# EAGLE design SAE_Shifter_Schem_no_micro (EAGLE 6.1)
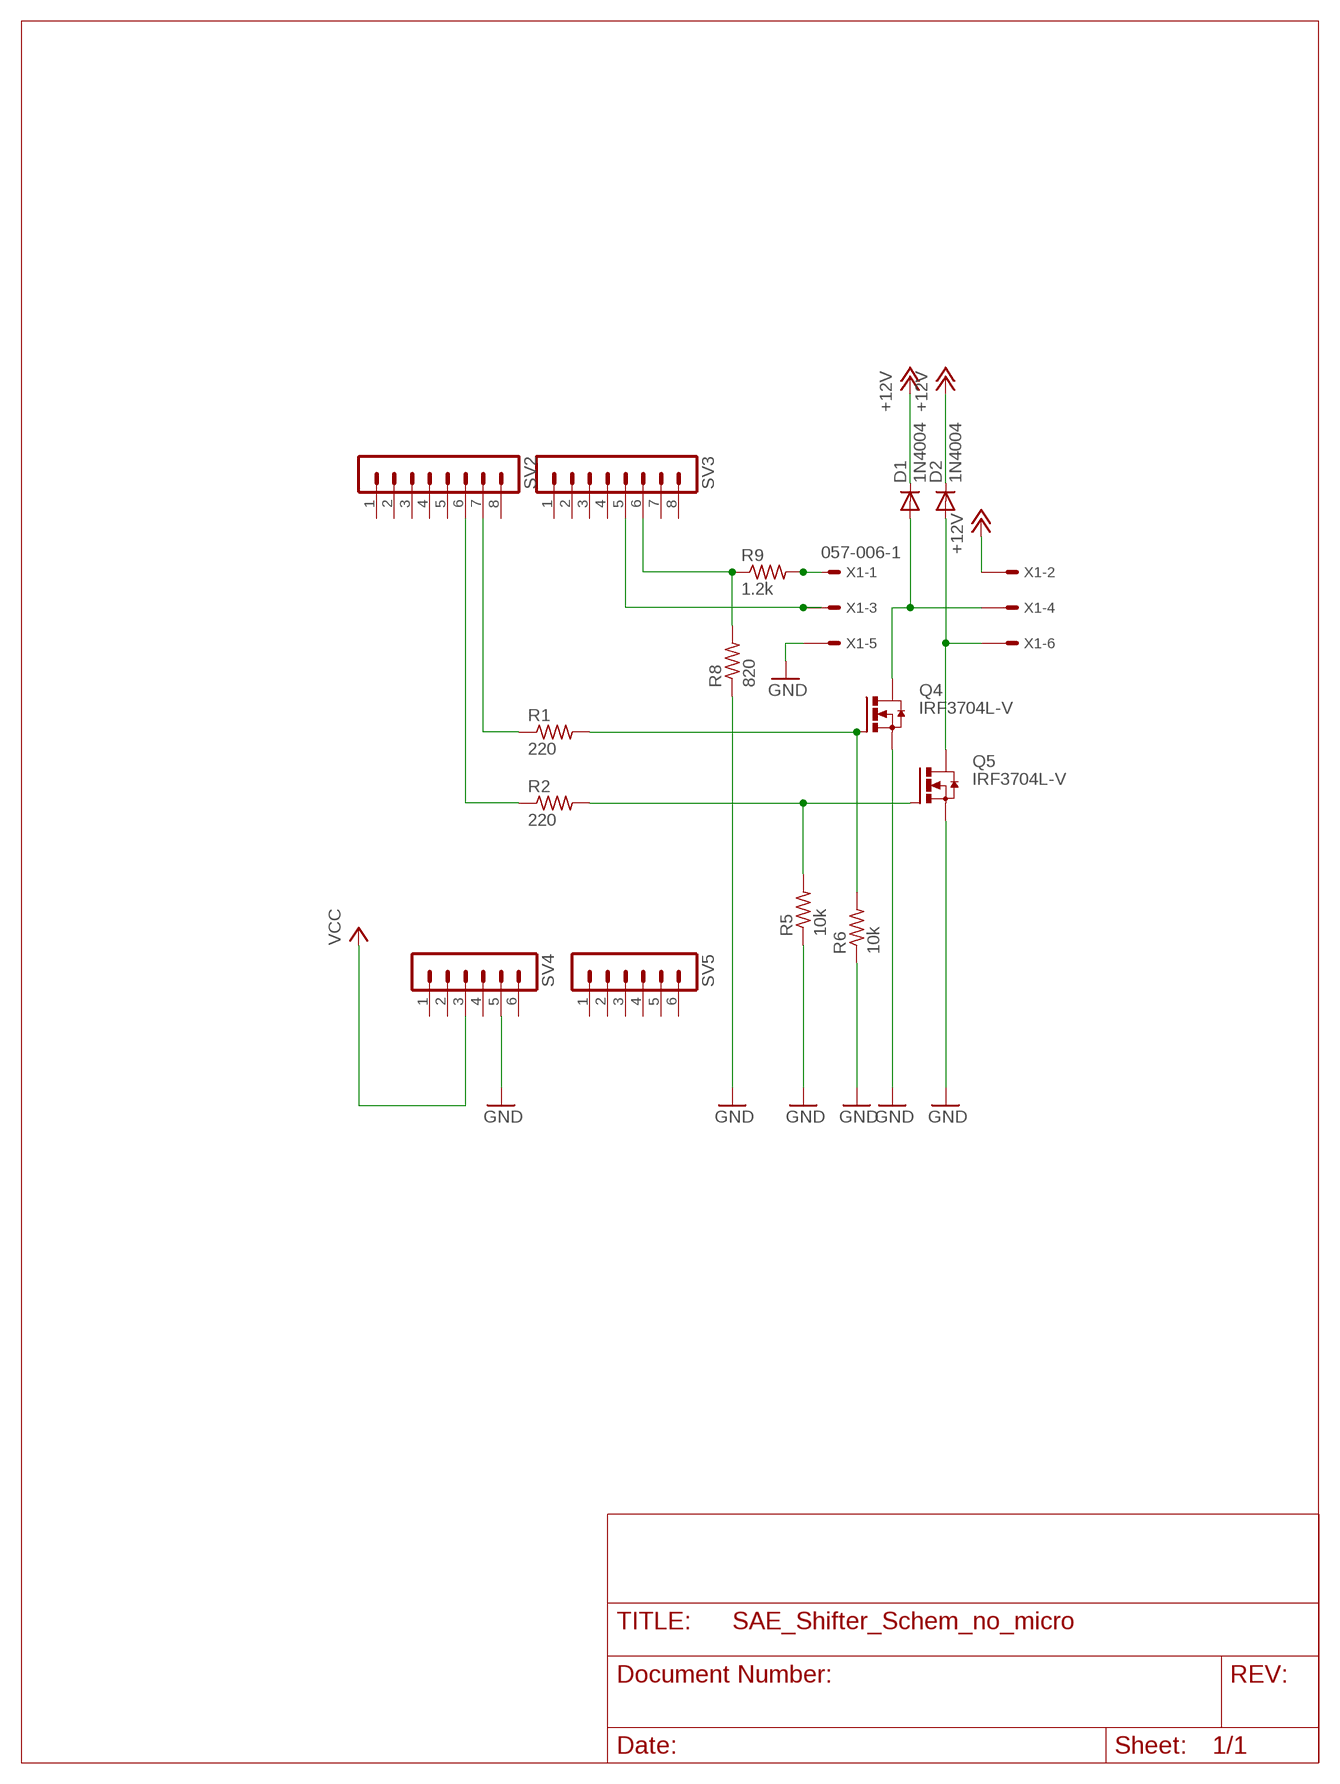
[diagram p0: schematic, sheet 1]

## Parts
D1  1N4004  [DO41-10]
D2  1N4004  [DO41-10]
Q4  IRF3704L-V  [TO262-V]
Q5  IRF3704L-V  [TO262-V]
R1  220  R-US_0207/10  [0207/10]
R2  220  R-US_0207/10  [0207/10]
R5  10k  R-US_0207/10  [0207/10]
R6  10k  R-US_0207/10  [0207/10]
R8  820  R-US_0207/10  [0207/10]
R9  1.2k  R-US_0207/10  [0207/10]
SV2  MA08-1  [MA08-1]
SV3  MA08-1  [MA08-1]
SV4  MA06-1  [MA06-1]
SV5  MA06-1  [MA06-1]
X1  057-006-1  [057-006-1]

## Nets
+12V: D1.C D2.C X1.2
GND: Q4.3(S) Q5.3(S) R5.1 R6.1 R8.1 SV4.5 X1.5
N$3: D1.A Q4.2(D) X1.4
N$4: D2.A Q5.2(D) X1.6
N$5: R1.1 SV2.7
N$6: R8.2 R9.1 SV3.6
N$8: Q5.1(G) R2.2 R5.2
N$10: SV3.5 X1.3
N$11: R2.1 SV2.6
N$12: R9.2 X1.1
N$13: Q4.1(G) R1.2 R6.2
VCC: SV4.3
Unconnected: SV2.1 SV2.2 SV2.3 SV2.4 SV2.5 SV2.8 SV3.1 SV3.2 SV3.3 SV3.4 SV3.7 SV3.8 SV4.1 SV4.2 SV4.4 SV4.6 SV5.1 SV5.2 SV5.3 SV5.4 SV5.5 SV5.6

## Library data of the parts
D1 D2 = diode:1N4004: DIODE general purpose rectifier, 1 A
Q4 Q5 = transistor-power:IRF3704: SMPS MOSFET HEXFET® Power MOSFET Source: http://www.irf.com/product-info/datasheets/data/irf3704.pdf
R1 R2 R5 R6 R8 R9 = resistor:R-US_: RESISTOR, American symbol
SV2 SV3 = con-lstb:MA08-1: PIN HEADER; OC_FARNELL: unknown; OC_NEWARK: unknown
SV4 SV5 = con-lstb:MA06-1: PIN HEADER; OC_FARNELL: unknown; OC_NEWARK: unknown
X1 = con-panduit:057-006-: CONNECTOR 6-pin series 057 contact pc board low profile headers; OC_FARNELL: unknown; OC_NEWARK: unknown

## Board
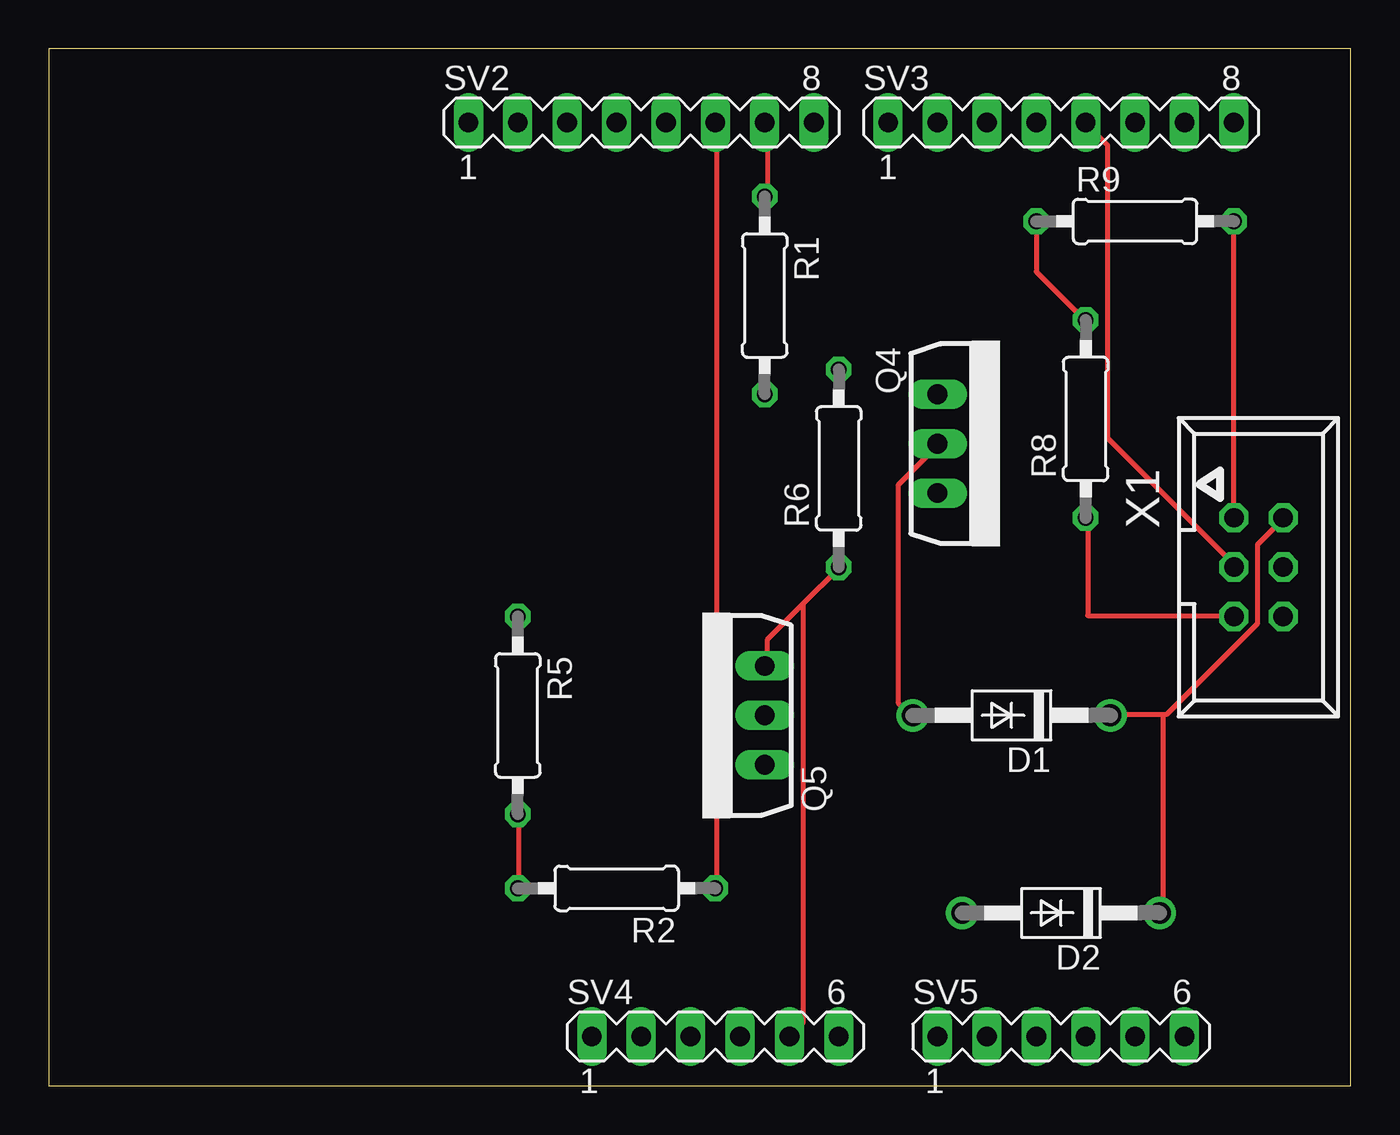
[diagram p1: board, top side]
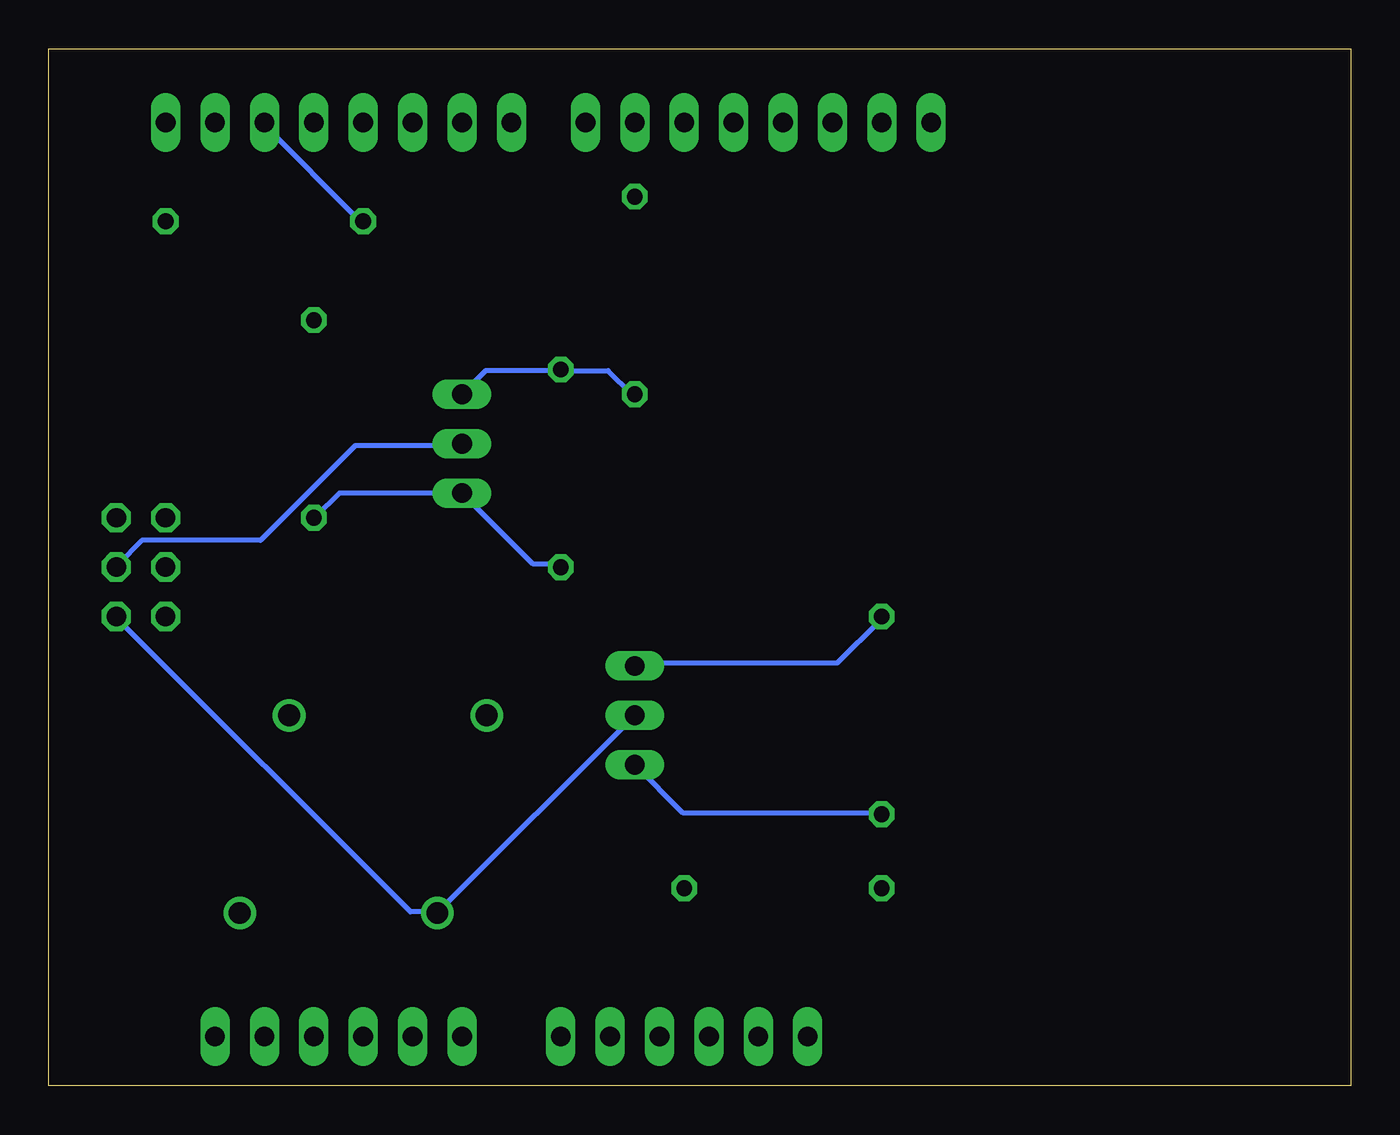
[diagram p2: board, bottom side, seen from below]

Size 66.98 x 53.33 mm. Coordinates in mm from the lower left corner, seen from the top.
Outline: 0,0 66.98,0 66.98,53.33 0,53.33 0,0
Copper layers (1*16): Top 0.035mm / dielectric 1.5mm / Bottom 0.035mm
Design rules: minimum track width 10mil, minimum drill 24mil, track to track 8mil, track to pad 8mil, pad to pad 8mil, via to via 8mil, smd to smd 8mil, copper to edge 40mil, drill to drill 8mil, minimum pad ring 10mil, minimum via ring 8mil, stop-mask expansion 4mil, vias tented up to drill 0mil, thermal gap 10mil

### Footprints (pad centres in the part's own frame; a part is rotated, then mirrored left to right if it is on the bottom)
DO41-10 = drill 1.118: A 5.08,0; C -5.08,0
TO262-V = drill 1.016 long: 1 -2.54,0; 2 0,0; 3 2.54,0
0207/10 = drill 0.813 octagon: 1 -5.08,0; 2 5.08,0
MA08-1 = drill 1.016 long: 1 -8.89,0; 2 -6.35,0; 3 -3.81,0; 4 -1.27,0; 5 1.27,0; 6 3.81,0; 7 6.35,0; 8 8.89,0
MA06-1 = drill 1.016 long: 1 -6.35,0; 2 -3.81,0; 3 -1.27,0; 4 1.27,0; 5 3.81,0; 6 6.35,0
057-006-1 = drill 1 octagon: 1 -2.54,-1.27; 2 -2.54,1.27; 3 0,-1.27; 4 0,1.27; 5 2.54,-1.27; 6 2.54,1.27

### Placement (x,y rotation side)
D1  49.53,19.05 180 top
D2  52.07,8.89 180 top
Q4  45.72,33.02 270 top
Q5  36.83,19.05 90 top
R1  36.83,40.64 270 top
R2  29.21,10.16 180 top
R5  24.13,19.05 270 top
R6  40.64,31.75 90 top
R8  53.34,34.29 90 top
R9  55.88,44.45 0 top
SV2  30.48,49.53 0 top
SV3  52.07,49.53 0 top
SV4  34.29,2.54 0 top
SV5  52.07,2.54 0 top
X1  62.23,26.67 270 top

### Tracks (layer width: path | path; a pad name or v marks a point on that pad's centre or on a via)
+12V
  Top 0.254: 57.3,19.1 54.66,19.1 D1.C | 57.3,19.1 57.51,19.1 62.18,23.77 62.18,27.84 63.4,29.06 X1.2 | 57.3,19.1 57.3,8.94 D2.C
GND
  Top 0.254: X1.5 60.96,24.18 53.44,24.18 53.44,29.06 R8.1 | 38.81,24.79 36.98,22.96 36.98,21.74 Q5.3 | 38.81,24.79 40.64,26.62 R6.1 | SV4.5 38.81,3.25 38.81,24.79
  Bottom 0.254: R8.1 53.24,29.26 52.02,30.48 Q4.3 42.06,26.82 40.64,26.82 R6.1 | R5.1 24.18,23.98 26.42,21.74 36.78,21.74 Q5.3
N$3
  Top 0.254: D1.A 44.3,19.1 43.69,19.71 43.69,30.89 45.72,32.92 Q4.2
  Bottom 0.254: X1.4 63.4,26.82 62.18,28.04 56.08,28.04 51.21,32.92 45.72,32.92 Q4.2
N$4
  Bottom 0.254: X1.6 63.4,23.98 48.36,8.94 47.14,8.94 D2.A Q5.2
N$5
  Top 0.254: R1.1 36.98,45.72 36.98,49.38 SV2.7
N$6
  Top 0.254: R9.1 50.8,41.86 53.24,39.42 R8.2
  Bottom 0.254: SV3.6 55.88,49.38 51,44.5 50.8,44.5 R9.1
N$8
  Top 0.254: R2.2 24.18,10.16 24.18,13.82 R5.2
  Bottom 0.254: Q5.1 34.34,14.02 24.18,14.02 R5.2
N$10
  Top 0.254: X1.3 60.96,26.82 54.46,33.33 54.46,48.36 53.44,49.38 SV3.5
N$11
  Top 0.254: R2.1 34.34,10.16 34.34,49.38 SV2.6
N$12
  Top 0.254: X1.1 R9.2
N$13
  Bottom 0.254: 40.64,36.78 38.2,36.78 36.98,35.56 R1.2 | Q4.1 44.5,36.78 40.64,36.78 | 40.64,36.78 R6.2